# Altium schematic sheet RJ45_Power_Reg.SchDoc: RJ45 Connector and Power Regulation
size 381 x 241 mm; CompanyName: Flat Earth Inc.; DrawnBy: Connor Dack; Engineer: Connor Dack; Address1: 985 Technology Blvd; Address2: Suite 102; Address3: Bozeman, MT, 59718; DocumentNumber: 5; Revision: 0.0; SheetNumber: 5; SheetTotal: 8
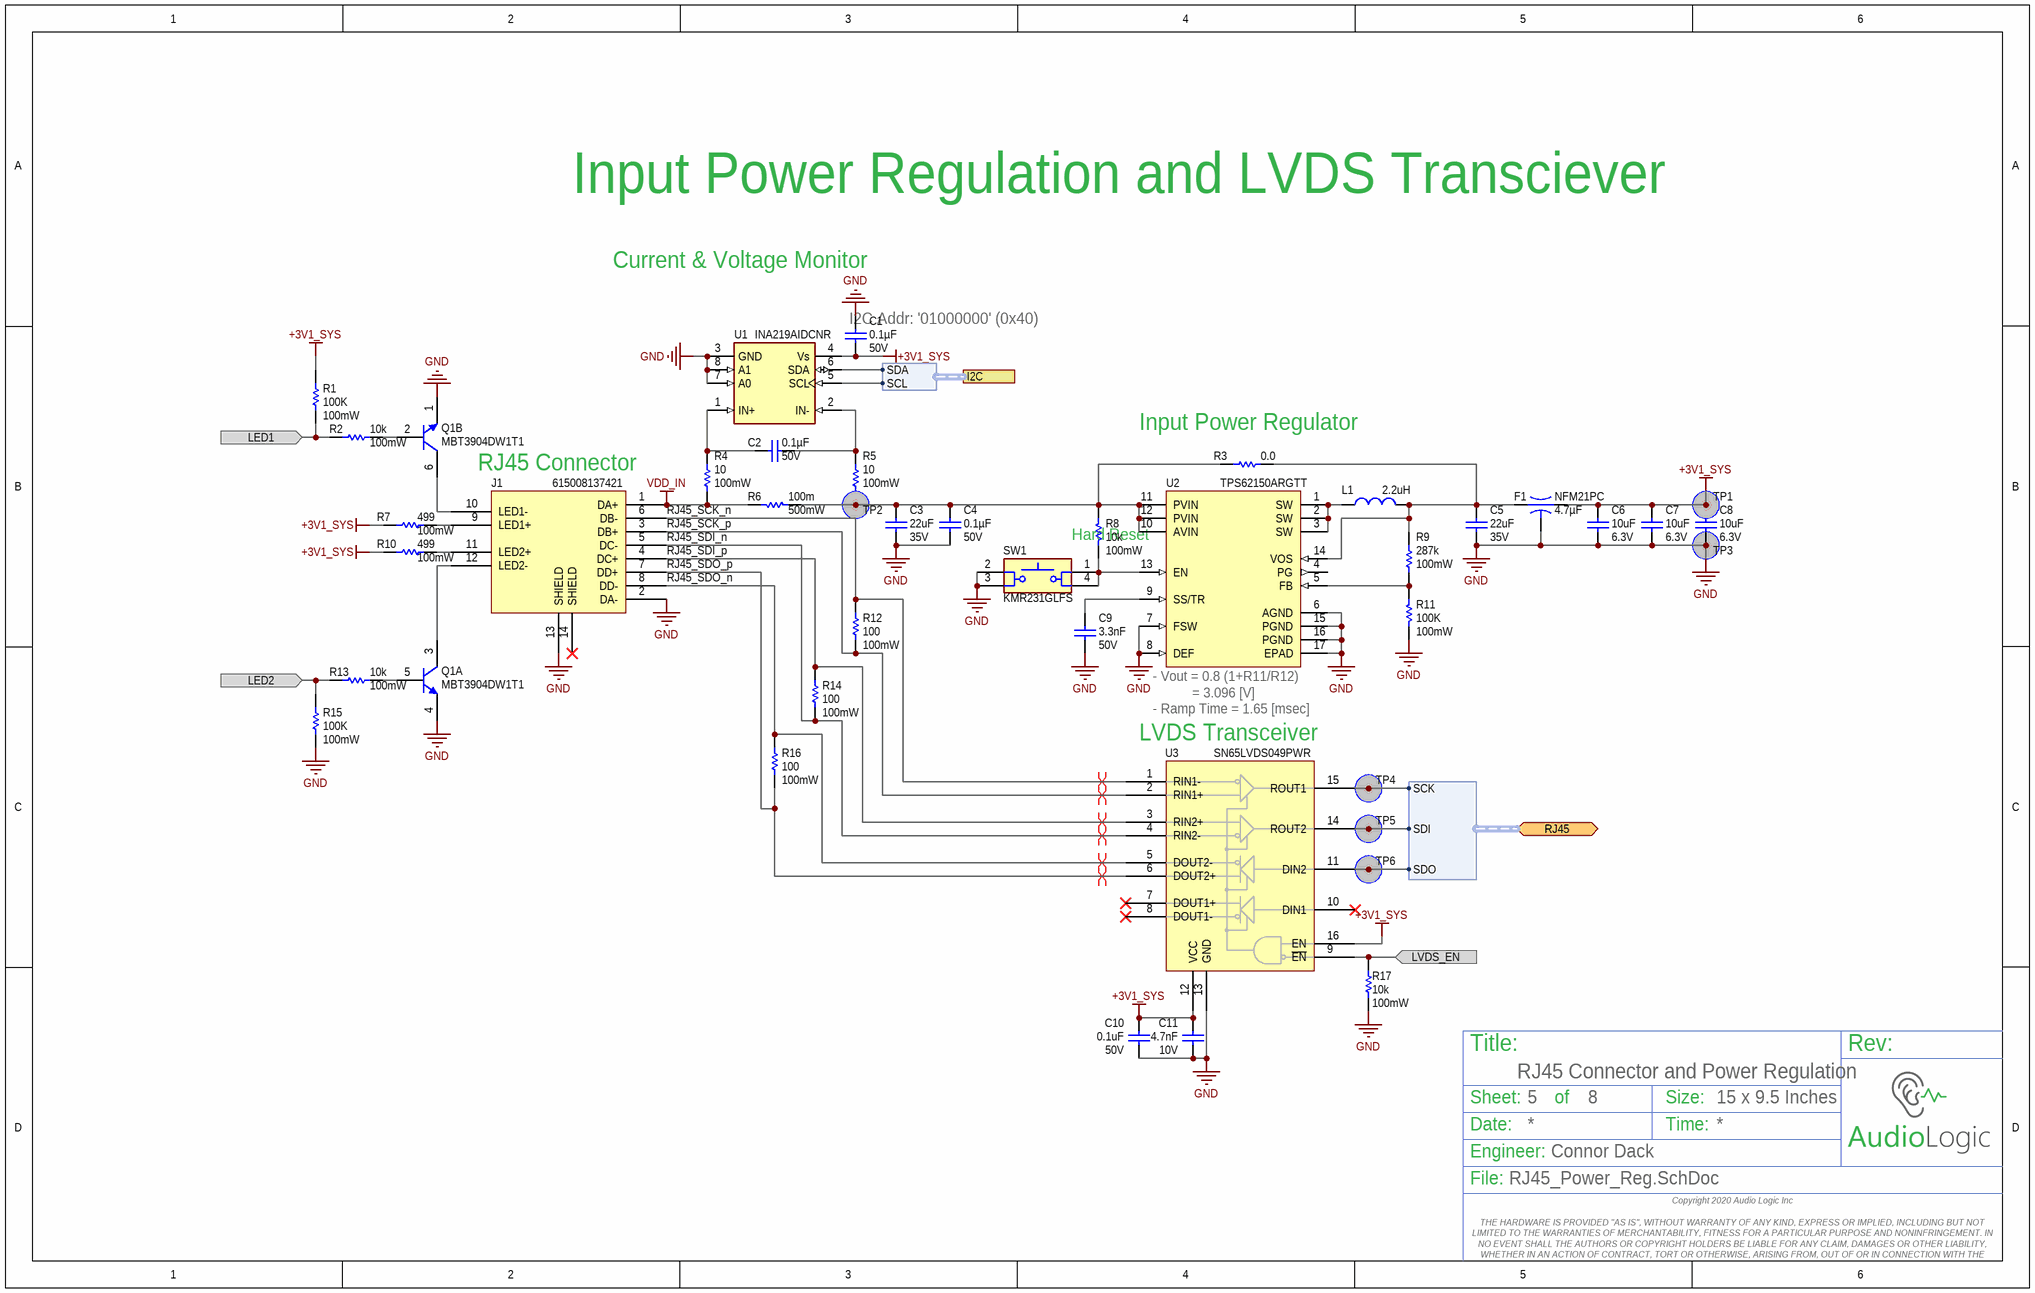
[diagram p0: RJ45_Power_Reg.SchDoc]

## Parts
C1  Voltage - Rated: 50V  Capacitance: 0.1µF  [2-0402_L]  (hidden comment: C1005X7R1H104K050BE)
C2  Voltage - Rated: 50V  Capacitance: 0.1µF  [2-0402_L]  (hidden comment: C1005X7R1H104K050BE)
C3  Voltage Rating: 35V  Capacitance: 22uF  [C1206]  (hidden comment: C3216X5R1V226M160AC)
C4  Voltage - Rated: 50V  Capacitance: 0.1µF  [2-0402_L]  (hidden comment: C1005X7R1H104K050BE)
C5  Voltage: 35V  Capacitance: 22uF  [C1206]  (hidden comment: C3216X5R1V226M160AC)
C6  Voltage Rating (DC): 6.3V  Capacitance: 10uF  [3-0603_L]  (hidden comment: JMK107ABJ106MAHT)
C7  Voltage Rating (DC): 6.3V  Capacitance: 10uF  [3-0603_L]  (hidden comment: JMK107ABJ106MAHT)
C8  Voltage Rating (DC): 6.3V  Capacitance: 10uF  [3-0603_L]  (hidden comment: JMK107ABJ106MAHT)
C9  Capacitance: 3.3nF  Voltage Rating: 50V  [CAPC1005X56X25NL10T15]  (hidden comment: 04025C332KAT2A)
C10  Capacitance: 0.1uF  Voltage Rating: 50V  [2-0402_L]  (hidden comment: UMK105B7104KVHF)
C11  Voltage Rating (DC): 10V  Capacitance: 4.7nF  [3-0603_L]  (hidden comment: C0603C472K8RACTU)
F1  NFM21PC  Capacitance: 4.7µF  [NFM21PC]
J1  CONN MOD JACK 8P8C R/A SHIELDED  [RJ45]  (value not drawn)
L1  Inductance: 2.2uH  [XFL4020]  (hidden comment: 2.2uH Ind)
Q1  MBT3904DW1T1  [ADI-KS-6_SC70_L]  (parts A,B of 2)
R1  Power (Watts): 100mW  Resistance (Ohms): 100K  [2-0402_R_L]  (hidden comment: ERJ-2RKF1003X)
R2  Power (Watts): 100mW  Resistance (Ohms): 10k  [2-0402_R_L]  (hidden comment: ERJ-2RKF1002X)
R3  Resistance (Ohms): 0.0  [6-0805_R_L]  (hidden comment: ERJ-6GEY0R00V)
R4  Power (Watts): 100mW  Resistance (Ohms): 10  [2-0402_R_L]  (hidden comment: ERJ-2RKF10R0X)
R5  Power (Watts): 100mW  Resistance (Ohms): 10  [2-0402_R_L]  (hidden comment: ERJ-2RKF10R0X)
R6  Max Power Dissipation: 500mW  Resistance: 100m  [6-0805_R_L]  (hidden comment: ERJ-6DSFR10V)
R7  Power (Watts): 100mW  Resistance (Ohms): 499  [2-0402_R_L]  (hidden comment: ERJ-2RKF4990X)
R8  Power (Watts): 100mW  Resistance (Ohms): 10k  [2-0402_R_L]  (hidden comment: ERJ-2RKF1002X)
R9  Resistance: 287k  Power Rating: 100mW  [RESC1005X40X25NL05T05]  (hidden comment: ERJ-2RKF2873X)
R10  Power (Watts): 100mW  Resistance (Ohms): 499  [2-0402_R_L]  (hidden comment: ERJ-2RKF4990X)
R11  Power (Watts): 100mW  Resistance (Ohms): 100K  [2-0402_R_L]  (hidden comment: ERJ-2RKF1003X)
R12  Power (Watts): 100mW  Resistance (Ohms): 100  [2-0402_R_L]  (hidden comment: ERJ-2RKF1000X)
R13  Power (Watts): 100mW  Resistance (Ohms): 10k  [2-0402_R_L]  (hidden comment: ERJ-2RKF1002X)
R14  Power (Watts): 100mW  Resistance (Ohms): 100  [2-0402_R_L]  (hidden comment: ERJ-2RKF1000X)
R15  Power (Watts): 100mW  Resistance (Ohms): 100K  [2-0402_R_L]  (hidden comment: ERJ-2RKF1003X)
R16  Power (Watts): 100mW  Resistance (Ohms): 100  [2-0402_R_L]  (hidden comment: ERJ-2RKF1000X)
R17  Power (Watts): 100mW  Resistance (Ohms): 10k  [2-0402_R_L]  (hidden comment: ERJ-2RKF1002X)
SW1  Manufacturer Part Number: KMR231GLFS  [CKCP-KMR231GLFS]  (hidden comment: SPST-NO)
TP1  Testpoint  [Testpoint_SMT]  (value not drawn)  (no BOM)
TP2  Testpoint  [Testpoint_SMT2]  (value not drawn)  (no BOM)
TP3  Testpoint  [Testpoint_SMT2]  (value not drawn)  (no BOM)
TP4  Testpoint  [Testpoint_SMT]  (value not drawn)  (no BOM)
TP5  Testpoint  [Testpoint_SMT]  (value not drawn)  (no BOM)
TP6  Testpoint  [Testpoint_SMT]  (value not drawn)  (no BOM)
U1  INA219AIDCNR  [SOT23-8]
U2  TPS62150ARGTT  [QFN50P300X300X100_HS-17N]
U3  SN65LVDS049PWR  [TSOP65P640X120-16N]

## Ports
I2C (harness I2C), LED1 (in), LED2 (in), LVDS_EN (in), RJ45 (bidir, harness RJ45)

## Harnesses
I2C: SCL, SDA
RJ45: SCK, SDI, SDO

## Nets
+3V1_SYS: C1.1 C6.2 C7.2 C8.2 C10.2 C11.2 F1.3(OUT) R1.2 R7.2 R10.2 TP1.1 U1.4(Vs) U3.12(VCC) U3.16(EN)
GND: C1.2 C3.1 C4.1 C5.1 C6.1 C7.1 C8.1 C9.1 C10.1 C11.1 F1.2(GND) J1.2(DA-) J1.13(SHIELD) Q1.1(E) Q1.4(E) R11.1 R15.1 R17.1 SW1.2 SW1.3 TP3.1 U1.3(GND) U1.7(A0) U1.8(A1) U2.6(AGND) U2.7(FSW) U2.8(DEF) U2.15(PGND) U2.16(PGND) U2.17(EPAD) U3.13(GND)
VDD_IN: J1.1(DA+) R4.1 R6.2
LED1: R1.1 R2.2 ; port LED1
LED2: R13.2 R15.2 ; port LED2
LVDS_EN: R17.2 U3.9(~{EN}) ; port LVDS_EN
RJ45_SCK_n: J1.6(DB-) R12.2 U3.1(RIN1-)
RJ45_SCK_p: J1.3(DB+) R12.1 U3.2(RIN1+)
RJ45_SDI_n: J1.5(DC-) R14.1 U3.4(RIN2-)
RJ45_SDI_p: J1.4(DC+) R14.2 U3.3(RIN2+)
RJ45_SDO_n: J1.8(DD-) R16.2 U3.5(DOUT2-)
RJ45_SDO_p: J1.7(DD+) R16.1 U3.6(DOUT2+)
NetC2_1: C2.1 R4.2 U1.1(IN+)
NetC2_2: C2.2 R5.2 U1.2(IN-)
NetC3_2: C3.2 C4.2 R3.1 R5.1 R6.1 R8.2 TP2.1 U2.10(AVIN) U2.11(PVIN) U2.12(PVIN)
NetC5_2: C5.2 F1.1(IN) L1.2 R3.2 R9.2 U2.14(VOS)
NetC9_2: C9.2 U2.9(SS/TR)
NetJ1_9: J1.9(LED1+) R7.1
NetJ1_10: J1.10(LED1-) Q1.6(C)
NetJ1_11: J1.11(LED2+) R10.1
NetJ1_12: J1.12(LED2-) Q1.3(C)
NetL1_1: L1.1 U2.1(SW) U2.2(SW) U2.3(SW)
NetQ1_2: Q1.2(B) R2.1
NetQ1_5: Q1.5(B) R13.1
NetR8_1: R8.1 SW1.1 SW1.4 U2.13(EN)
NetR9_1: R9.1 R11.2 U2.5(FB)
NetTP4_1: TP4.1 U3.15(ROUT1) ; port RJ45.SCK
NetTP5_1: TP5.1 U3.14(ROUT2) ; port RJ45.SDI
NetTP6_1: TP6.1 U3.11(DIN2) ; port RJ45.SDO
NetU1_5: U1.5(SCL) ; port I2C.SCL
NetU1_6: U1.6(SDA) ; port I2C.SDA

Not connected (* = marked no-connect by the designer): J1 14(SHIELD)*; SW1 5(GND); U2 4(PG); U3 7(DOUT1+)* 8(DOUT1-)* 10(DIN1)*

## Layout directives
differential pair: RJ45_SCK_n, RJ45_SCK_p, RJ45_SDI_n, RJ45_SDI_p, RJ45_SDO_n, RJ45_SDO_p

## Notes on the sheet
- Input Power Regulation and LVDS Transciever
- Current & Voltage Monitor
- (near C1) I2C Addr: '01000000' (0x40)
- (near R3) Input Power Regulator
- RJ45 Connector
- Hard Reset
- LVDS Transceiver
- (near U2) - Vout = 0.8 (1+R11/R12)
  = 3.096 [V]
  - Ramp Time = 1.65 [msec]
- Title:
- Sheet:
- of
- Size:
- 15 x 9.5 Inches
- Rev:
- Date:
- Engineer:
- Time:
- File:
- Copyright 2020 Audio Logic Inc
  THE HARDWARE IS PROVIDED "AS IS", WITHOUT WARRANTY OF ANY KIND, EXPRESS OR IMPLIED, INCLUDING BUT NOT LIMITED TO THE WARRANTIES OF MERCHANTABILITY, FITNESS FOR A PARTICULAR PURPOSE AND NONINFRINGEMENT. IN NO EVENT SHALL THE AUTHORS OR COPYRIGHT HOLDERS BE LIABLE FOR ANY CLAIM, DAMAGES OR OTHER LIABILITY, WHETHER IN AN ACTION OF CONTRACT, TORT OR OTHERWISE, ARISING FROM, OUT OF OR IN CONNECTION WITH THE HARDWARE OR THE USE OR OTHER DEALINGS IN THE HARDWARE.

## Library data of the parts
C1 C2 C4 = C1005X7R1H104K050BE: CAP CER 0.1UF 50V X7R 0402; Manufacturer: TDK Corporation; Tolerance: ±10%; Supplier 1: Digi-Key; Manufacturer Part Number: C1005X7R1H104K050BE; RoHS: RoHS Compliant; Category: Capacitors; Stock 1: 211300; Pricing 1: 1=0.19, 10=0.133, 100=0.0673, 500=0.04604, 1000=0.04073, 2500=0.03896, 5000=0.03542 (USD); Packaging: Cut Tape (CT); Part Status: Active; Temperature Coefficient: X7R; Operating Temperature: -55°C ~ 125°C; Features: Soft Termination; Ratings: -; Applications: Boardflex Sensitive; Failure Rate: -; Mounting Type: Surface Mount, MLCC; Package / Case: 0402 (1005 Metric); Size / Dimension: 0.039" L x 0.020" W (1.00mm x 0.50mm); Height - Seated (Max): -; Thickness (Max): 0.024" (0.60mm); Lead Spacing: -; Lead Style: -; ComponentLink1URL: https://product.tdk.com/info/en/catalog/datasheets/mlcc_commercial_soft_en.pdf; ComponentLink1Description: https://product.tdk.com/info/en/catalog/datasheets/mlcc_commercial_soft_en.pdf; Supplier Part Number 1: 445-173610-1-ND
C3 C5 = C3216X5R1V226M160AC: CAP CER 22UF 35V X5R 1206; Manufacturer: TDK; Dielectric Material: Ceramic; Tolerance: 20%; Supplier 1: Digi-Key; Manufacturer Part Number: C3216X5R1V226M160AC; Stock 1: 881642; Pricing 1: 1=1.11, 10=0.873, 100=0.6546, 500=0.49462, 1000=0.43643 (USD); Mount: Surface Mount; Case/Package: 1206; Weight: 0.000571oz; Case Code (Metric): 3216; Case Code (Imperial): 1206; Min Operating Temperature: -55°C; Max Operating Temperature: 85°C; Package Quantity: 2000; Packaging: Tape and Reel; Voltage Rating (DC): 35V; Dielectric: X5R; Termination: SMD/SMT; Composition: Ceramic; Length: 3.2mm; Height: 1.6mm; Width: 0.063inch; Depth: 1.6mm; Thickness: 1.6mm; Radiation Hardening: No; REACH SVHC: No SVHC; Lead Free: Lead Free; ComponentLink1URL: https://datasheet.ciiva.com/23803/1796654-23803046.pdf; ComponentLink1Description: https://datasheet.ciiva.com/23803/1796654-23803046.pdf; ComponentLink2URL: https://datasheet.ciiva.com/22725/1913358-22725591.pdf; ComponentLink2Description: https://datasheet.ciiva.com/22725/1913358-22725591.pdf; ComponentLink3URL: https://datasheet.ciiva.com/22725/1913358-22725592.pdf; ComponentLink3Description: https://datasheet.ciiva.com/22725/1913358-22725592.pdf; ComponentLink4URL: https://datasheet.ciiva.com/24216/c3216x5r1v226m160ac-265035-24216573.pdf; ComponentLink4Description: https://datasheet.ciiva.com/24216/c3216x5r1v226m160ac-265035-24216573.pdf; ComponentLink5URL: https://datasheet.ciiva.com/6259/tdkmlcccaprange-6259231.pdf; ComponentLink5Description: https://datasheet.ciiva.com/6259/tdkmlcccaprange-6259231.pdf; Supplier Part Number 1: 445-8045-1-ND
  C3: Voltage: 35V
  C5: Voltage Rating: 35V
C6-C8 = JMK107ABJ106MAHT: CAP CER 10UF 6.3V X5R 0603; Manufacturer: Taiyo Yuden; Tolerance: 20%; Supplier 1: Digi-Key; Manufacturer Part Number: JMK107ABJ106MAHT; Stock 1: 40000; Pricing 1: 1=0.22, 10=0.149, 100=0.0755, 500=0.05166, 1000=0.04571 (USD); Mount: Surface Mount; Case/Package: 0603; Case Code (Imperial): 0603; Case Code (Metric): 1608; Contact Plating: Nickel,Tin; Min Operating Temperature: -55°C; Max Operating Temperature: 85°C; Packaging: Tape and Reel; Voltage Rating: 6.3V; Package Quantity: 4000; Dielectric: X5R; Termination: SMD/SMT; Length: 1.6mm; Height: 0.8mm; Width: 0.8mm; Thickness: 0.035inch; Lead Free: Lead Free; Halogen Free: Halogen Free; ComponentLink1URL: https://datasheet.ciiva.com/18697/mlcc01-hq-e-18697804.pdf; ComponentLink1Description: https://datasheet.ciiva.com/18697/mlcc01-hq-e-18697804.pdf; ComponentLink2URL: https://datasheet.ciiva.com/18697/mlcc01-hq-e-18697805.pdf; ComponentLink2Description: https://datasheet.ciiva.com/18697/mlcc01-hq-e-18697805.pdf; ComponentLink3URL: https://datasheet.ciiva.com/18697/mlcc01-hq-e-18697806.pdf; ComponentLink3Description: https://datasheet.ciiva.com/18697/mlcc01-hq-e-18697806.pdf; Supplier Part Number 1: 587-3383-1-ND
C9 = CMP-2008-02721-1: CAP CER 3300PF 50V X7R 0402; Manufacturer: AVX Interconnect / Elco; Tolerance: 10%; Part Number: 04025C332KAT2A; Supplier 1: Digi-Key; Supplier Part Number 1: 478-1107-1-ND; Manufacturer Part Number: 04025C332KAT2A; RoHS: Yes; Category: Ceramic Capacitors; Stock 1: 249568; Pricing 1: 1=0.15000, 10=0.10600, 100=0.05000, 500=0.03508, 1000=0.02904, 2500=0.02702, 5000=0.02473 (USD); Mount: Surface Mount,PCB; Case/Package: 0402; Case Code (Metric): 1005; Case Code (Imperial): 0402; Contact Plating: Tin,Matte; Min Operating Temperature: -55°C; Max Operating Temperature: 125°C; Packaging: Tape and Reel; Package Quantity: 10000; Dielectric: X7R; Termination: SMD/SMT; Voltage: 50V; Length: 1mm; Height: 0.56mm; Width: 0.02inch; Depth: 0.5mm; Thickness: 0.022inch; Radiation Hardening: No; Lead Free: Lead Free; REACH SVHC: No SVHC; ComponentLink1URL: https://datasheet.ciiva.com/11786/0900766b80dc2409-11786773.pdf?src-supplier=RSComponents; ComponentLink1Description: https://datasheet.ciiva.com/11786/0900766b80dc2409-11786773.pdf?src-supplier=RSComponents; ComponentLink2URL: https://datasheet.ciiva.com/34303/2009172-34303798.pdf?src-supplier=Jameco; ComponentLink2Description: https://datasheet.ciiva.com/34303/2009172-34303798.pdf?src-supplier=Jameco; ComponentLink3URL: https://datasheet.ciiva.com/156/cx7r-156722.pdf?src-supplier=Digi-Key; ComponentLink3Description: https://datasheet.ciiva.com/156/cx7r-156722.pdf?src-supplier=Digi-Key; ComponentLink4URL: https://datasheet.ciiva.com/156/cx7r-156723.pdf?src-supplier=Digi-Key; ComponentLink4Description: https://datasheet.ciiva.com/156/cx7r-156723.pdf?src-supplier=Digi-Key; ComponentLink5URL: https://datasheet.ciiva.com/156/cx7r-156724.pdf?src-supplier=Digi-Key; ComponentLink5Description: https://datasheet.ciiva.com/156/cx7r-156724.pdf?src-supplier=Digi-Key; ComponentLink6URL: https://datasheet.ciiva.com/1123/84526-1123768.pdf?src-supplier=Element14; ComponentLink6Description: https://datasheet.ciiva.com/1123/84526-1123768.pdf?src-supplier=Element14; ComponentLink7URL: https://datasheet.ciiva.com/1123/84526-1123769.pdf?src-supplier=Element14; ComponentLink7Description: https://datasheet.ciiva.com/1123/84526-1123769.pdf?src-supplier=Element14; ComponentLink8URL: https://datasheet.ciiva.com/5416/cx7r-5416188.pdf?src-supplier=Mouser; ComponentLink8Description: https://datasheet.ciiva.com/5416/cx7r-5416188.pdf?src-supplier=Mouser; ComponentLink9URL: https://datasheet.ciiva.com/15165/getdatasheetpartid-63678-15165405.pdf?src-supplier=Verical; ComponentLink9Description: https://datasheet.ciiva.com/15165/getdatasheetpartid-63678-15165405.pdf?src-supplier=Verical
C10 = UMK105B7104KVHF: CAP CER 0.1uF 50V X7R +/-10% 0402 AEC-Q200; Manufacturer: Taiyo Yuden; Tolerance: 10%; Supplier 1: Digi-Key; Manufacturer Part Number: UMK105B7104KVHF; Stock 1: 100000; Pricing 1: 1=0.23, 10=0.165, 100=0.0775, 500=0.05436, 1000=0.04501, 2500=0.04189, 5000=0.03832 (USD); Packaging: Tape and Reel; ComponentLink1URL: http://www.yuden.co.jp/productdata/catalog/en/mlcc01_hq_e.pdf; ComponentLink1Description: http://www.yuden.co.jp/productdata/catalog/en/mlcc01_hq_e.pdf; Supplier Part Number 1: 587-4330-1-ND; Mount: Surface Mount; Case/Package: 0402; Case Code (Metric): 1005; Case Code (Imperial): 0402; Min Operating Temperature: -55°C; Max Operating Temperature: 125°C; Package Quantity: 10000; Dielectric: X7R; Voltage Rating (DC): 50V; Length: 0.039inch; Height: 0.5mm; Width: 0.02inch; Thickness: 0.022inch; ComponentLink2URL: http://ds.yuden.co.jp/TYCOMPAS/ut/detail.do?productNo=UMK105B7104KVHF&fileName=UMK105B7104KVHF_SS&mode=specSheetDownload; ComponentLink2Description: http://ds.yuden.co.jp/TYCOMPAS/ut/detail.do?productNo=UMK105B7104KVHF&fileName=UMK105B7104KVHF_SS&mode=specSheetDownload; ComponentLink3URL: http://www.mouser.com/ds/2/396/mlcc11_hq_e-541564.pdf; ComponentLink3Description: http://www.mouser.com/ds/2/396/mlcc11_hq_e-541564.pdf; ComponentLink4URL: http://ds.yuden.co.jp/TYCOMPAS/ut/detail.do?productNo=UMK105B7104KVHF&dataUnit=M; ComponentLink4Description: http://ds.yuden.co.jp/TYCOMPAS/ut/detail.do?productNo=UMK105B7104KVHF&dataUnit=M; Weight: 2.3E-05oz; Termination: SMD/SMT
C11 = C0603C472K8RACTU: CAP CER 4700PF 10V X7R 0603; Manufacturer: KEMET; Dielectric Material: Ceramic; Tolerance: 10%; Supplier 1: Digi-Key; Manufacturer Part Number: C0603C472K8RACTU; Stock 1: 15005; Pricing 1: 1=0.1, 10=0.053, 100=0.0236, 500=0.0168, 1000=0.0132 (USD); Mount: Surface Mount; Case/Package: 0603; Case Code (Metric): 1608; Case Code (Imperial): 0603; Contact Plating: Tin,Matte; Min Operating Temperature: -55°C; Max Operating Temperature: 125°C; Voltage Rating: 10V; Packaging: Tape and Reel; Package Quantity: 4000; Dielectric: X7R; Termination: SMD/SMT; Length: 1.6mm; Width: 0.031inch; Thickness: 0.034inch; Depth: 0.8mm; REACH SVHC: No SVHC; ComponentLink1URL: http://www.mouser.com/ds/2/212/KEM_C1002_X7R_SMD-1102033.pdf; ComponentLink1Description: http://www.mouser.com/ds/2/212/KEM_C1002_X7R_SMD-1102033.pdf; ComponentLink2URL: http://components.arrow.com/part/dataview/3445604S8609586N7429; ComponentLink2Description: http://components.arrow.com/part/dataview/3445604S8609586N7429; ComponentLink3URL: https://search.kemet.com/component-edge/download/datasheet/C0603C472K8RACTU.pdf; ComponentLink3Description: https://search.kemet.com/component-edge/download/datasheet/C0603C472K8RACTU.pdf; ComponentLink4URL: http://capacitoredge.kemet.com/capedge2/DataSheet?pn=C0603C472K8RAC7867; ComponentLink4Description: http://capacitoredge.kemet.com/capedge2/DataSheet?pn=C0603C472K8RAC7867; Supplier Part Number 1: 399-9092-6-ND
F1 = NFM21PC475B1A3D: CAP FEEDTHRU 4.7UF 20% 10V 0805; Manufacturer: Murata Electronics North America; DC Resistance (DCR) (Max): 5 mOhm; Current: 6A; Supplier 1: Digi-Key; RoHS: RoHS Compliant; Category: Filters; Stock 1: 23508; Pricing 1: 1=0.42, 10=0.349, 50=0.2706, 100=0.2405, 250=0.2164, 500=0.19838, 1000=0.16832 (USD); Packaging: Cut Tape (CT); Part Status: Active; Tolerance: ±20%; Voltage - Rated: 10V; Operating Temperature: -40°C ~ 85°C; Insertion Loss: -; Temperature Coefficient: -; Ratings: -; Mounting Type: Surface Mount; Package / Case: 0805 (2012 Metric), 3 PC Pad; Size / Dimension: 0.079" L x 0.049" W (2.00mm x 1.25mm); Height (Max): 0.037" (0.95mm); ComponentLink1URL: http://search.murata.co.jp/Ceramy/image/img/PDF/ENG/L0111S0111NFM21PC.pdf; ComponentLink1Description: http://search.murata.co.jp/Ceramy/image/img/PDF/ENG/L0111S0111NFM21PC.pdf; Supplier Part Number 1: 490-6983-1-ND; Manufacturer Part Number: NFM21PC475B1A3D
J1 = 615008137421: Jack Modular Connector 8p8c (RJ45, Ethernet) 90° Angle (Right) Shielded, EMI Finger Cat5; Manufacturer: Wurth Electronics; Current Rating: 1.5A; Mating Cycles: 500; Gender: Female; Connector Type: RJ45,Socket,Jack; Voltage Rating (AC): 120V; Number of Positions: 8; Number of Ports: 1; Insulation Resistance: 500MR; Direction: Up; Supplier 1: Digi-Key; Stock 1: 1494; Pricing 1: 1=2.67, 10=2.621, 50=2.52, 100=2.419, 250=2.318 (USD); Mount: Through Hole,PCB; Contact Plating: Tin,Gold; Contact Material: Copper Alloy; Colour: Black,Green,Yellow; Housing Material: PBT; Min Operating Temperature: -40°C; Max Operating Temperature: 85°C; Shielding: Shielded; Packaging: Tray; Package Quantity: 60; Number of Rows: 1; Termination: Through Hole; Number of Contacts: 8; Orientation: Right Angle; Length: 13.46mm; Height: 16.93mm; Width: 16.25mm; Depth: 15.75mm; REACH SVHC: Unknown; Flammability Rating: UL94 V-0; ComponentLink1URL: https://datasheet.ciiva.com/11726/0900766b80f88673-11726176.pdf; ComponentLink1Description: https://datasheet.ciiva.com/11726/0900766b80f88673-11726176.pdf; ComponentLink2URL: https://datasheet.ciiva.com/4561/615008137421-71402-4561624.pdf; ComponentLink2Description: https://datasheet.ciiva.com/4561/615008137421-71402-4561624.pdf; ComponentLink3URL: https://datasheet.ciiva.com/686/615008137421-686729.pdf; ComponentLink3Description: https://datasheet.ciiva.com/686/615008137421-686729.pdf; ComponentLink4URL: https://datasheet.ciiva.com/6913/76606-6913951.pdf; ComponentLink4Description: https://datasheet.ciiva.com/6913/76606-6913951.pdf; ComponentLink5URL: https://datasheet.ciiva.com/48689/001088215-da-01-en-wr-com-modular-jack-615008137421-48689541.pdf; ComponentLink5Description: https://datasheet.ciiva.com/48689/001088215-da-01-en-wr-com-modular-jack-615008137421-48689541.pdf; Supplier Part Number 1: 732-2112-ND; Manufacturer Part Number: 615008137421
L1 = XFL4020-222MEB: Fixed Inductors XFL4020 AEC-Q200 2.2 uH 20 % 8 A; Manufacturer: Coilcraft; Core Material: Composite; Tolerance: 20%; Self Resonant Frequency: 38MHz; Shielding: Shielded; Max DC Current: 8A; DC Resistance (DCR): 23.5mR; Test Frequency: 100kHz; ComponentLink1URL: http://www.mouser.com/ds/2/597/xfl4020-270756.pdf; ComponentLink1Description: http://www.mouser.com/ds/2/597/xfl4020-270756.pdf; ComponentLink2URL: http://www.mouser.com/ds/2/597/xfl3012-270750.pdf?src-supplier=Mouser; ComponentLink2Description: http://www.mouser.com/ds/2/597/xfl3012-270750.pdf?src-supplier=Mouser; Supplier 1: Mouser; Manufacturer Part Number: XFL4020-222MEB; Stock 1: 10998; Pricing 1: 1=2.13, 10=2.13, 50=1.85, 100=1.55, 500=0.96, 1000=0.884, 2000=0.823, 10000=0.823 (USD); Min Operating Temperature: -40°C; Max Operating Temperature: 125°C; Packaging: Tape and Reel; Termination: SMD/SMT; Package Quantity: 25; Length: 4.3mm; Height: 2.1mm; Width: 4.3mm; Lead Free: Contains Lead; Supplier Part Number 1: 994-XFL4020-222MEB
Q1 = MBT3904DW1T1: TRANS DUAL GP 200MA 40V SC88; Manufacturer: ON Semiconductor; Manufacturer Part Number: MBT3904DW1T1G; Transistor Type: 2 NPN (Dual); Vce Saturation (Max) @ Ib, Ic: 300mV @ 5mA, 50mA; DC Current Gain (hFE) (Min) @ Ic, Vce: 100 @ 10mA, 1V; Power - Max: 150mW; Frequency - Transition: 300MHz; Supplier 1: Digi-Key; RoHS: RoHS Compliant; Category: Discrete Semiconductor Products; Stock 1: 95313; Pricing 1: 1=0.26, 10=0.241, 25=0.1732, 100=0.1347, 250=0.08464, 500=0.0721, 1000=0.04913 (USD); Current - Collector (Ic) (Max): 200mA; Voltage - Collector Emitter Breakdown (Max): 40V; Current - Collector Cutoff (Max): -; Mounting Type: Surface Mount; Package / Case: 6-TSSOP, SC-88, SOT-363; Supplier Device Package: SC-88; Packaging: Cut Tape (CT); ComponentLink1URL: http://www.onsemi.com/pub_link/Collateral/MBT3904DW1T1-D.PDF; ComponentLink1Description: http://www.onsemi.com/pub_link/Collateral/MBT3904DW1T1-D.PDF; Supplier Part Number 1: MBT3904DW1T1GOSCT-ND; SymName: MBT3904DW1T1
R1 R11 R15 = ERJ-2RKF1003X: RES 100K OHM 1/10W 1% 0402 SMD; Manufacturer: Panasonic - ECG; Temperature Coefficient: ±100ppm/°C; Supplier 1: Digi-Key; Manufacturer Part Number: ERJ-2RKF1003X; RoHS: RoHS Compliant; Category: Resistors; Stock 1: 2576552; Pricing 1: 1=0.1, 50=0.0242, 100=0.0184, 250=0.01364, 500=0.01008, 1000=0.00672, 5000=0.00473 (USD); Composition: Thick Film; Features: -; Tolerance: ±1%; Package / Case: 0402 (1005 Metric); Size / Dimension: 0.039" L x 0.020" W (1.00mm x 0.50mm); Height: 0.016" (0.40mm); Number of Terminations: 2; Packaging: Cut Tape (CT); ComponentLink1URL: http://industrial.panasonic.com/www-cgi/jvcr13pz.cgi?E+PZ+3+AOA0002+ERJ2RKF1003X+7+WW; ComponentLink1Description: http://industrial.panasonic.com/www-cgi/jvcr13pz.cgi?E+PZ+3+AOA0002+ERJ2RKF1003X+7+WW; Supplier Part Number 1: P100KLCT-ND
R2 R8 R13 R17 = ERJ-2RKF1002X: RES 10K OHM 1/10W 1% 0402 SMD; Manufacturer: Panasonic Electronic Components; Temperature Coefficient: ±100ppm/°C; Supplier 1: Digi-Key; Manufacturer Part Number: ERJ-2RKF1002X; RoHS: RoHS Compliant; Category: Resistors; Stock 1: 5701592; Pricing 1: 1=0.1, 50=0.0196, 100=0.0149, 250=0.01104, 500=0.00816, 1000=0.00544, 5000=0.00383 (USD); Packaging: Cut Tape (CT); Tolerance: ±1%; Composition: Thick Film; Features: -; Package / Case: 0402 (1005 Metric); Supplier Device Package: 0402; Size / Dimension: 0.039" L x 0.020" W (1.00mm x 0.50mm); Height: 0.016" (0.40mm); Number of Terminations: 2; ComponentLink1URL: http://industrial.panasonic.com/www-cgi/jvcr13pz.cgi?E+PZ+3+AOA0002+ERJ2RKF1002X+7+WW; ComponentLink1Description: http://industrial.panasonic.com/www-cgi/jvcr13pz.cgi?E+PZ+3+AOA0002+ERJ2RKF1002X+7+WW; Supplier Part Number 1: P10.0KLCT-ND
R3 = ERJ-6GEY0R00V: RES 0.0 OHM 1/8W 0805 SMD; Manufacturer: Panasonic - ECG; Tolerance: Jumper; Power (Watts): 0.125W, 1/8W; Supplier 1: Digi-Key; Manufacturer Part Number: ERJ-6GEY0R00V; RoHS: RoHS Compliant; Category: Resistors; Stock 1: 1649858; Pricing 1: 1=0.05, 50=0.0172, 100=0.0131, 250=0.00976, 500=0.0072, 1000=0.0048 (USD); Packaging: Cut Tape (CT); Composition: Thick Film; Features: -; Temperature Coefficient: -; Package / Case: 0805 (2012 Metric); Size / Dimension: 0.079" L x 0.049" W (2.00mm x 1.25mm); ComponentLink1URL: http://industrial.panasonic.com/www-cgi/jvcr13pz.cgi?E+PZ+3+AOA0001+ERJ6GEY0R00V+7+WW; ComponentLink1Description: http://industrial.panasonic.com/www-cgi/jvcr13pz.cgi?E+PZ+3+AOA0001+ERJ6GEY0R00V+7+WW; Supplier Part Number 1: P0.0ACT-ND; Height: 0.028" (0.70mm); Number of Terminations: 2
R4 R5 = ERJ-2RKF10R0X: RES 10 OHM 1/10W 1% 0402 SMD; Manufacturer: Panasonic Electronic Components; Temperature Coefficient: ±100ppm/°C; Supplier 1: Digi-Key; Manufacturer Part Number: ERJ-2RKF10R0X; RoHS: RoHS Compliant; Category: Resistors; Stock 1: 1086258; Pricing 1: 1=0.1, 50=0.0196, 100=0.0149, 250=0.01104, 500=0.00816, 1000=0.00544, 5000=0.00383 (USD); Packaging: Cut Tape (CT); Tolerance: ±1%; Composition: Thick Film; Features: -; Package / Case: 0402 (1005 Metric); Supplier Device Package: 0402; Size / Dimension: 0.039" L x 0.020" W (1.00mm x 0.50mm); Height: 0.016" (0.40mm); Number of Terminations: 2; ComponentLink1URL: http://industrial.panasonic.com/www-cgi/jvcr13pz.cgi?E+PZ+3+AOA0002+ERJ2RKF10R0X+7+WW; ComponentLink1Description: http://industrial.panasonic.com/www-cgi/jvcr13pz.cgi?E+PZ+3+AOA0002+ERJ2RKF10R0X+7+WW; Supplier Part Number 1: P10.0LCT-ND
R6 = ERJ-6DSFR10V: RES SMD 0.1 OHM 1% 1/2W 0805; Manufacturer: Panasonic; Temperature Coefficient: 150ppm/°C; Supplier 1: Digi-Key; Manufacturer Part Number: ERJ-6DSFR10V; Stock 1: 3141; Pricing 1: 1=0.5, 10=0.36, 25=0.266, 50=0.196, 100=0.1438, 250=0.11884, 500=0.09798, 1000=0.07088 (USD); Packaging: Cut Tape; Tolerance: 1%; Composition: Thick Film; ComponentLink1URL: https://industrial.panasonic.com/cdbs/www-data/pdf/RDN0000/AOA0000C313.pdf; ComponentLink1Description: https://industrial.panasonic.com/cdbs/www-data/pdf/RDN0000/AOA0000C313.pdf; Supplier Part Number 1: P19308CT-ND; Case/Package: 0805; Case Code (Metric): 2012; Case Code (Imperial): 0805; Min Operating Temperature: -55°C; Max Operating Temperature: 155°C; Number of Terminations: 2; Length: 0.079inch; Height: 0.028inch; Width: 0.049inch
R7 R10 = ERJ-2RKF4990X: RES 499 OHM 1/10W 1% 0402 SMD; Manufacturer: Panasonic Electronic Components; Temperature Coefficient: ±100ppm/°C; Supplier 1: Digi-Key; Manufacturer Part Number: ERJ-2RKF4990X; RoHS: RoHS Compliant; Category: Resistors; Stock 1: 781785; Pricing 1: 1=0.1, 50=0.0196, 100=0.0149, 250=0.01104, 500=0.00816, 1000=0.00544, 5000=0.00383 (USD); Packaging: Cut Tape (CT); Tolerance: ±1%; Composition: Thick Film; Features: Automotive AEC-Q200 Qualified; Operating Temperature: -55°C ~ 155°C; Package / Case: 0402 (1005 Metric); Supplier Device Package: 0402; Size / Dimension: 0.039" L x 0.020" W (1.00mm x 0.50mm); Height: 0.016" (0.40mm); Number of Terminations: 2; ComponentLink1URL: http://industrial.panasonic.com/www-cgi/jvcr13pz.cgi?E+PZ+3+AOA0002+ERJ2RKF4990X+7+WW; ComponentLink1Description: http://industrial.panasonic.com/www-cgi/jvcr13pz.cgi?E+PZ+3+AOA0002+ERJ2RKF4990X+7+WW; Supplier Part Number 1: P499LCT-ND
R9 = CMP-2002-00839-1: RES SMD 287K OHM 1% 1/10W 0402; Manufacturer: Panasonic; Voltage Rating: 50V; Temperature Coefficient: 100ppm/°C; Part Number: ERJ-2RKF2873X; Supplier 1: Digi-Key; Supplier Part Number 1: P287KLCT-ND; Manufacturer Part Number: ERJ-2RKF2873X; RoHS: Yes; Category: Chip SMD Resistors; Stock 1: 392833; Pricing 1: 1=0.10000, 10=0.05000, 100=0.02030, 1000=0.00912, 2500=0.00791, 5000=0.00654 (USD); Mount: Surface Mount; Case/Package: 0402; Case Code (Metric): 1005; Case Code (Imperial): 0402; Contact Plating: Tin; Min Operating Temperature: -55°C; Max Operating Temperature: 155°C; Tolerance: 1%; Packaging: Tape and Reel; Package Quantity: 1; Composition: Thick Film; Number of Terminations: 2; Termination: SMD/SMT; Military Standard: Not; Max Power Dissipation: 100mW; Voltage Rating (DC): 50V; Features: Automotive AEC-Q200; Length: 1mm; Height: 0.35mm; Width: 0.02inch; Depth: 0.5mm; REACH SVHC: No SVHC; Lead Free: Lead Free; ComponentLink1URL: https://datasheet.ciiva.com/16776/70260748-16776197.pdf?src-supplier=Allied+Electronics; ComponentLink1Description: https://datasheet.ciiva.com/16776/70260748-16776197.pdf?src-supplier=Allied+Electronics; ComponentLink2URL: https://datasheet.ciiva.com/30125/aoa0000ce2-30125319.pdf?src-supplier=Onlinecomponents.com; ComponentLink2Description: https://datasheet.ciiva.com/30125/aoa0000ce2-30125319.pdf?src-supplier=Onlinecomponents.com; ComponentLink3URL: https://datasheet.ciiva.com/46373/1678782-46373063.pdf?src-supplier=Element14; ComponentLink3Description: https://datasheet.ciiva.com/46373/1678782-46373063.pdf?src-supplier=Element14; ComponentLink4URL: https://datasheet.ciiva.com/46373/1678782-46373064.pdf?src-supplier=Element14; ComponentLink4Description: https://datasheet.ciiva.com/46373/1678782-46373064.pdf?src-supplier=Element14; ComponentLink5URL: https://datasheet.ciiva.com/24024/aoa0000ce2-24024729.pdf?src-supplier=Mouser; ComponentLink5Description: https://datasheet.ciiva.com/24024/aoa0000ce2-24024729.pdf?src-supplier=Mouser; ComponentLink6URL: https://datasheet.ciiva.com/22721/1678782-22721978.pdf?src-supplier=Farnell; ComponentLink6Description: https://datasheet.ciiva.com/22721/1678782-22721978.pdf?src-supplier=Farnell
R12 R14 R16 = ERJ-2RKF1000X: RES 100 OHM 1/10W 1% 0402 SMD; Manufacturer: Panasonic Electronic Components; Temperature Coefficient: ±100ppm/°C; Supplier 1: Digi-Key; Manufacturer Part Number: ERJ-2RKF1000X; RoHS: RoHS Compliant; Category: Resistors; Stock 1: 2273632; Pricing 1: 1=0.1, 50=0.0242, 100=0.0184, 250=0.01364, 500=0.01008, 1000=0.00672, 5000=0.00473 (USD); Composition: Thick Film; Features: -; Tolerance: ±1%; Package / Case: 0402 (1005 Metric); Supplier Device Package: 0402; Size / Dimension: 0.039" L x 0.020" W (1.00mm x 0.50mm); Height: 0.016" (0.40mm); Number of Terminations: 2; Packaging: Cut Tape (CT); ComponentLink1URL: http://industrial.panasonic.com/www-cgi/jvcr13pz.cgi?E+PZ+3+AOA0002+ERJ2RKF1000X+7+WW; ComponentLink1Description: http://industrial.panasonic.com/www-cgi/jvcr13pz.cgi?E+PZ+3+AOA0002+ERJ2RKF1000X+7+WW; Supplier Part Number 1: P100LCT-ND
SW1 = SW-SPST-NO_KMR231GLFS: SWITCH TACTILE SPST-NO 0.05A 32V; Manufacturer: ITT C&K; Mechanical Life: 150000Cycles; Throw Configuration: SPST; Operating Force: 3N; Max Current Rating: 50mA; Contact Resistance: 100mR; Power Rating: 1W; Illumination Type: Non-Illuminated,Illuminated; Insulation Resistance: 1GR; Switch Travel: 0.25mm; Switch Function: Off-Mom; Actuator Length: 0.5mm; Supplier 1: Digi-Key; Stock 1: 33091; Pricing 1: 1=0.57, 10=0.553, 25=0.5428, 50=0.5222, 100=0.4506, 250=0.4096, 500=0.38912, 1000=0.3072 (USD); Mount: Surface Mount; Case/Package: SMD/SMT; Contact Plating: Silver; Contact Material: Silver; Min Operating Temperature: -40°C; Max Operating Temperature: 85°C; Max Voltage Rating (DC): 32V; Termination: Gull Wing; Contact Current Rating: 50mA; Voltage Rating (DC): 32V; Packaging: Tape and Reel; Package Quantity: 1; Current Rating: 50mA; Orientation: Straight; Length: 2.8mm; Width: 4.6mm; Depth: 4.6mm; Radiation Hardening: No; REACH SVHC: No SVHC; Lead Free: Lead Free; ComponentLink1URL: https://datasheet.ciiva.com/16443/kmr231glfs-16443008.pdf; ComponentLink1Description: https://datasheet.ciiva.com/16443/kmr231glfs-16443008.pdf; ComponentLink2URL: https://datasheet.ciiva.com/16155/kmr231glfs-ckcomponents-16155429.pdf; ComponentLink2Description: https://datasheet.ciiva.com/16155/kmr231glfs-ckcomponents-16155429.pdf; ComponentLink3URL: https://datasheet.ciiva.com/29903/getdatasheetpartid-763492-29903765.pdf; ComponentLink3Description: https://datasheet.ciiva.com/29903/getdatasheetpartid-763492-29903765.pdf; ComponentLink4URL: https://datasheet.ciiva.com/2900/kmr2-9aug12-2900231.pdf; ComponentLink4Description: https://datasheet.ciiva.com/2900/kmr2-9aug12-2900231.pdf; ComponentLink5URL: https://datasheet.ciiva.com/2900/kmr2-9aug12-2900232.pdf; ComponentLink5Description: https://datasheet.ciiva.com/2900/kmr2-9aug12-2900232.pdf; ComponentLink6URL: https://datasheet.ciiva.com/2900/kmr2-9aug12-2900233.pdf; ComponentLink6Description: https://datasheet.ciiva.com/2900/kmr2-9aug12-2900233.pdf; ComponentLink7URL: https://datasheet.ciiva.com/16692/kmr2-9aug12-16692969.pdf; ComponentLink7Description: https://datasheet.ciiva.com/16692/kmr2-9aug12-16692969.pdf; ComponentLink8URL: https://datasheet.ciiva.com/7986/1792623-7986954.pdf; ComponentLink8Description: https://datasheet.ciiva.com/7986/1792623-7986954.pdf; ComponentLink9URL: https://datasheet.ciiva.com/26827/kmr2-9aug12-26827228.pdf; ComponentLink9Description: https://datasheet.ciiva.com/26827/kmr2-9aug12-26827228.pdf; Supplier Part Number 1: 401-1429-1-ND
TP1-TP6 = Testpoint_SMT: Testpoint, 1-Pin, SMT; System: Connector
U1 = INA219AIDCNR: IC CURRENT MONITOR 1% SOT23-8; Manufacturer: Texas Instruments; Min Supply Voltage: 3V; Max Supply Voltage: 5.5V; Nominal Supply Current: 700uA; Common Mode Rejection Ratio: 100dB; Output Current: 10mA; Bandwidth: 3.4MHz; Min Input Voltage: 0uV; Max Input Voltage: 26V; Operating Supply Current: 1mA; Number of Amplifiers: 1; Input Offset Voltage (Vos): 100uV; Max Supply Current: 5mA; Output Type: Digital; Supplier 1: Digi-Key; Stock 1: 17294; Pricing 1: 1=2.14, 10=1.922, 100=1.5445, 500=1.26896, 1000=1.05142 (USD); Case/Package: SOT-23-8; Number of Pins: 8; Min Operating Temperature: -40°C; Max Operating Temperature: 125°C; Packaging: Tape and Reel; ComponentLink1URL: https://datasheet.ciiva.com/1492/ina219-1492467.pdf; ComponentLink1Description: Datasheet; Supplier Part Number 1: 296-23770-1-ND; Manufacturer Part Number: INA219AIDCNR; Package Quantity: 3000; Accuracy: 1%; Quiescent Current: 700uA; Radiation Hardening: No; Lead Free: Lead Free; Weight: 0.001411oz; Contact Plating: Gold; Output Current per Channel: 10mA; Features: I²C; Length: 3mm; Height: 1.3mm; Width: 1.75mm; REACH SVHC: No SVHC
U2 = TPS62150ARGTT: TEXAS INSTRUMENTS         TPS62150ARGTT            DC-DC Switching Buck Step Down Regulator, Adjustable, 3V-17Vin, 900mV-6Vout, 1Aout, QFN-16; Output Voltage: 6V; Output Current: 1A; Min Input Voltage: 3V; Number of Outputs: 1; Max Input Voltage: 17V; Switching Frequency: 2.5MHz; Min Output Voltage: 900mV; Synchronous Rectifier: Yes; Quiescent Current: 17uA; Output Type: Adjustable,Fixed; Output Configuration: Positive; Supplier 1: Digi-Key; Manufacturer: Texas Instruments; Manufacturer Part Number: TPS62150ARGTT; RoHS: Yes; Category: Voltage Regulators - Switching; Stock 1: 1026; Pricing 1: 1=2.15000, 10=1.93200, 25=1.82320, 100=1.45850 (USD); Mount: Surface Mount; Case/Package: QFN; Number of Pins: 16; Contact Plating: Gold; Min Operating Temperature: -40°C; Max Operating Temperature: 125°C; Packaging: Tape and Reel; Package Quantity: 1; Max Output Current: 1A; Min Supply Voltage: 3V; Max Output Voltage: 6V; Operating Supply Voltage: 17V; Length: 3.15mm; Height: 0.95mm; Width: 3.15mm; Radiation Hardening: No; REACH SVHC: No SVHC; Lead Free: Lead Free; ComponentLink1URL: https://datasheet.ciiva.com/22748/1751885-22748323.pdf?src-supplier=Element14; ComponentLink1Description: https://datasheet.ciiva.com/22748/1751885-22748323.pdf?src-supplier=Element14; ComponentLink2URL: https://datasheet.ciiva.com/29885/tps62150a-29885704.pdf?src-supplier=Avnet; ComponentLink2Description: https://datasheet.ciiva.com/29885/tps62150a-29885704.pdf?src-supplier=Avnet; ComponentLink3URL: https://datasheet.ciiva.com/18552/tps62150a-18552774.pdf?src-supplier=Digi-Key; ComponentLink3Description: https://datasheet.ciiva.com/18552/tps62150a-18552774.pdf?src-supplier=Digi-Key; Supplier Part Number 1: 296-36472-1-ND
U3 = SN65LVDS049PWR: IC LVDS DUAL DIF DVR/RCV 16TSSOP; Manufacturer: Texas Instruments; Max Power Dissipation: 774mW; Nominal Supply Current: 35mA; Propagation Delay: 3.5ns; Max Supply Voltage: 3.6V; Min Supply Voltage: 3V; Number of Receivers: 2; Operating Supply Voltage: 3.3V; Data Rate: 400Mbps; Logic Function: Transceiver,Receiver; Max Input Current: 20uA; Max Output Voltage: 450mV; Supplier 1: Digi-Key; Manufacturer Part Number: SN65LVDS049PWR; RoHS: Yes; Category: Interface ICs; Stock 1: 4055; Pricing 1: 1=2.54000, 10=2.28200, 25=2.15280, 100=1.72220, 250=1.50688, 500=1.46384, 1000=1.16246 (USD); Case/Package: TSSOP; Number of Pins: 16; Weight: 0.002116oz; Contact Plating: Gold; Min Operating Temperature: -40°C; Max Operating Temperature: 85°C; Packaging: Tape and Reel; Package Quantity: 1; Number of Elements: 2; Number of Drivers: 2; Power Dissipation: 774mW; Turn-On Delay Time: 3.5ns; Radiation Hardening: No; Lead Free: Lead Free; REACH SVHC: No SVHC; ComponentLink1URL: https://datasheet.ciiva.com/1703/sn65lvds049-1703872.pdf?src-supplier=Digi-Key; ComponentLink1Description: https://datasheet.ciiva.com/1703/sn65lvds049-1703872.pdf?src-supplier=Digi-Key; ComponentLink2URL: https://datasheet.ciiva.com/15133/getdatasheetpartid-298932-15133393.pdf?src-supplier=Verical; ComponentLink2Description: https://datasheet.ciiva.com/15133/getdatasheetpartid-298932-15133393.pdf?src-supplier=Verical; ComponentLink3URL: https://datasheet.ciiva.com/26828/sn65lvds049pwr-26828740.pdf?src-supplier=IIIC; ComponentLink3Description: https://datasheet.ciiva.com/26828/sn65lvds049pwr-26828740.pdf?src-supplier=IIIC; ComponentLink4URL: https://datasheet.ciiva.com/1703/sn65lvds049-1703873.pdf?src-supplier=Digi-Key; ComponentLink4Description: https://datasheet.ciiva.com/1703/sn65lvds049-1703873.pdf?src-supplier=Digi-Key; ComponentLink5URL: https://datasheet.ciiva.com/3152/sn65lvds049-3152685.pdf?src-supplier=Avnet; ComponentLink5Description: https://datasheet.ciiva.com/3152/sn65lvds049-3152685.pdf?src-supplier=Avnet; Supplier Part Number 1: 296-26358-1-ND